# EasyEDA schematic easyeda-doit-devkit-v1.json
TITLE: Sheet_1; REV: 1.0; Date: 2025-05-14; Sheet: 1/1; Drawn By: pgalantha; Company: Your Company
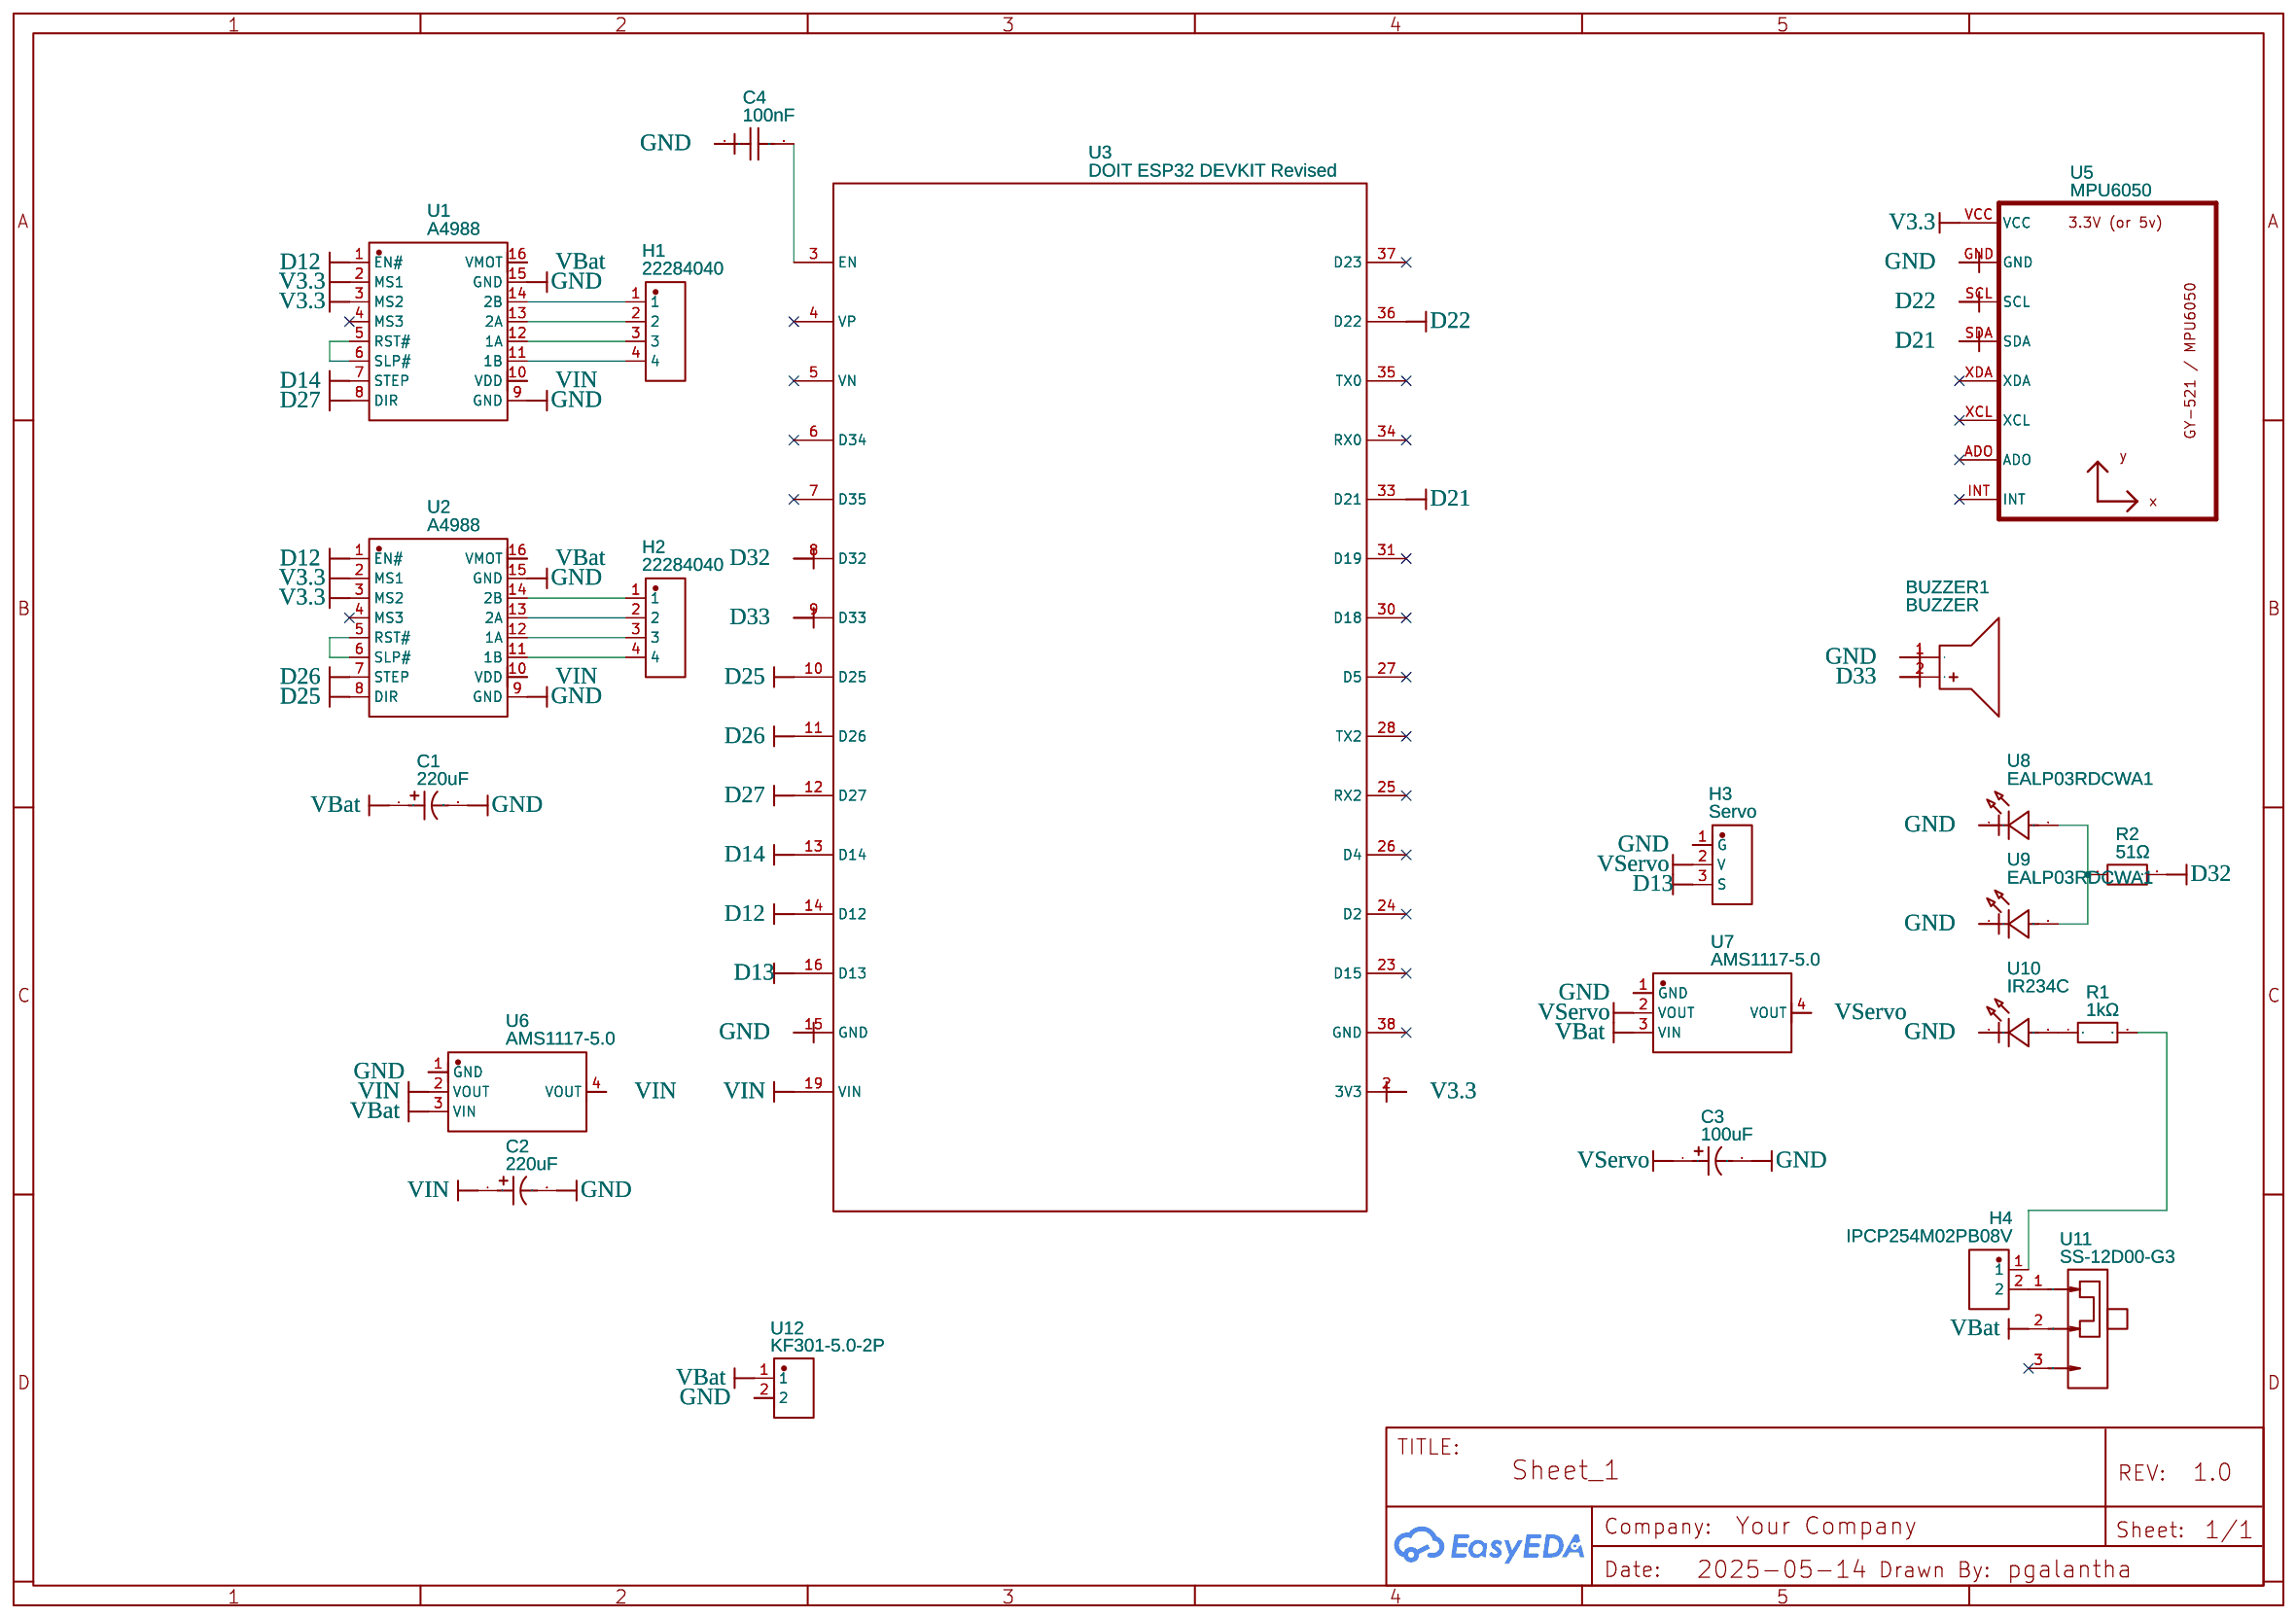
[diagram p0: schematic sheet]

## Parts
BUZZER1  BUZZER  [BUZ-TH_BD12.0-P6.00-D0.9-RD]
C1  220uF  [CAP-TH_BD6.3-P2.50-D0.5-FD]
C2  220uF  [CAP-TH_BD6.3-P2.50-D0.5-FD]
C3  100uF  [CAP-TH_BD5.0-P2.00-D0.5-FD-1]
C4  100nF  [CAP-TH_L5.0-W2.5-P5.00-D1.0]
H1  22284040  [HDR-TH_4P-P2.54-V-M]
H2  22284040  [HDR-TH_4P-P2.54-V-M]
H3  Servo  [HDR-TH_3P-P2.54-V-M]
H4  IPCP254M02PB08V  [HDR-TH_2P-P2.54-V-M]
R1  1kΩ  [RES-TH_BD3.3-L9.2-P13.20-D0.6]
R2  51Ω  [RES-TH_BD3.3-L9.2-P13.20-D0.6]
U1  A4988  [DIP-16_L20.3-W15.2-P2.54_LS12.7_A4988]
U2  A4988  [DIP-16_L20.3-W15.2-P2.54_LS12.7_A4988]
U3  DOIT ESP32 DEVKIT Revised  [DOIT-ESP32-DEVKIT-V1-REVISED]
U5  MPU6050  [MPU6050]
U6  AMS1117-5.0  [SOT-223_L6.5-W3.5-P2.30-LS7.0-BR]
U7  AMS1117-5.0  [SOT-223_L6.5-W3.5-P2.30-LS7.0-BR]
U8  EALP03RDCWA1  [LED-TH_BD3.0-P2.54-RD]
U9  EALP03RDCWA1  [LED-TH_BD3.0-P2.54-RD]
U10  IR234C  [LED-TH_BD3.0-P2.54-RD]
U11  SS-12D00-G3  [SW-TH_3P-L8.8-W3.9-P2.50_SS12D00G3]
U12  KF301-5.0-2P  [CONN-TH_P5.00_KF301-5.0-2P]

## Library data of the parts
BUZZER1 = BUZZER: Contributor: lcsc; Supplier: LCSC; Supplier Part: C9900014030; Manufacturer: null; Manufacturer Part: buzzer; JLCPCB Part Class: Extended Part
C1 C2 = SY221M016E070A: Contributor: lcsc; Supplier: LCSC; Supplier Part: C531135; Manufacturer: CapXon(丰宾); JLCPCB Part Class: Extended Part
C3 = 16V100UF CD288: Contributor: lcsc; Supplier: LCSC; Supplier Part: C2960195; Manufacturer: HRK(鸿瑞凯电子); Manufacturer Part: 16V100uF CD288; JLCPCB Part Class: Extended Part
C4 = CC1H104MC1FD3F6C10MF: Contributor: LCSC; Supplier: LCSC; Supplier Part: C254085; Manufacturer: Dersonic(德尔创); JLCPCB Part Class: Extended Part
H1 H2 = 22284040: Contributor: LCSC; Supplier: LCSC; Supplier Part: C587039; Manufacturer: MOLEX; JLCPCB Part Class: Extended Part
H3 = 22284035: Contributor: LCSC; Supplier: LCSC; Supplier Part: C587038; Manufacturer: MOLEX; JLCPCB Part Class: Extended Part
H4 = IPCP254M02PB08V: Supplier: LCSC; Supplier Part: C22395601; Manufacturer: INCP; JLCPCB Part Class: Extended Part; Contributor: lcsc
R1 = RN1WS1KΩFT/BA1: Contributor: LCSC; Supplier: LCSC; Supplier Part: C385291; Manufacturer: Tyohm(幸亚电阻); JLCPCB Part Class: Extended Part
R2 = RN 1/2W 51R F T/B A1: Contributor: LCSC; Supplier: LCSC; Supplier Part: C433505; Manufacturer: Tyohm(幸亚电阻); JLCPCB Part Class: Extended Part
U1 U2 = A4988: Supplier: LCSC; Supplier Part: C9900168373; Manufacturer: null; Contributor: lcsc
U3 = DOIT ESP32 DEVKIT Revised: Manufacturer: Espressif Systems; Manufacturer Part: M103QH3200PH3Q0; Supplier: Digi-Key; Supplier Part: 1904-ESP32-WROOM-32; link: https://www.digikey.com.au/en/products/detail/espressif-systems/ESP32-WROOM-32-M103QH3200PH3Q0/17887554; Contributor: syzygy36au
U5 = MPU6050: Contributor: salman hamid
U6 U7 = AMS1117-5.0: sourceId: HltLFyQwq; Supplier: LCSC; Manufacturer: AMS; Supplier Part: C6187; JLCPCB Part Class: Basic Part
U8 U9 = EALP03RDCWA1: Supplier: LCSC; Supplier Part: C2992760; Manufacturer: EVERLIGHT(亿光); JLCPCB Part Class: Extended Part; Contributor: lcsc
U10 = IR234C: Supplier: LCSC; Supplier Part: C5201641; Manufacturer: EVERLIGHT(亿光); JLCPCB Part Class: Extended Part; Contributor: lcsc
U11 = SS-12D00-G3: Supplier: LCSC; Supplier Part: C22355741; Manufacturer: SOFNG(硕方); Contributor: lcsc; JLCPCB Part Class: Extended Part
U12 = KF301-5.0-2P: Contributor: LCSC; Supplier: LCSC; Supplier Part: C474881; Manufacturer: KEFA(科发); JLCPCB Part Class: Extended Part

## Nets
GND: BUZZER1.1(-) C1.2 C2.2 C3.2 C4.1 H3.1(G) U1.9(GND) U1.15(GND) U2.9(GND) U2.15(GND) U3.15(GND) U5.GND U6.1(GND) U7.1(GND) U8.1(K) U9.1(K) U10.1(C) U12.2
V3.3: U1.2(MS1) U1.3(MS2) U2.2(MS1) U2.3(MS2) U3.2(3V3) U5.VCC
VBat: C1.1 U1.16(VMOT) U2.16(VMOT) U6.3(VIN) U7.3(VIN) U11.2 U12.1
VIN: C2.1 U1.10(VDD) U2.10(VDD) U3.19(VIN) U6.2(VOUT) U6.4(VOUT)
D12: U1.1(EN#) U2.1(EN#) U3.14(D12)
D13: H3.3(S) U3.16(D13)
D14: U1.7(STEP) U3.13(D14)
D21: U3.33(D21) U5.SDA
D22: U3.36(D22) U5.SCL
D25: U2.8(DIR) U3.10(D25)
D26: U2.7(STEP) U3.11(D26)
D27: U1.8(DIR) U3.12(D27)
D32: R2.2 U3.8(D32)
D33: BUZZER1.2(+) U3.9(D33)
VServo: C3.1 H3.2(V) U7.2(VOUT) U7.4(VOUT)
Net-(C4-2): C4.2 U3.3(EN)
Net-(H1-1): H1.1 U1.14(2B)
Net-(H1-2): H1.2 U1.13(2A)
Net-(H1-3): H1.3 U1.12(1A)
Net-(H1-4): H1.4 U1.11(1B)
Net-(H2-1): H2.1 U2.14(2B)
Net-(H2-2): H2.2 U2.13(2A)
Net-(H2-3): H2.3 U2.12(1A)
Net-(H2-4): H2.4 U2.11(1B)
Net-(H4-1): H4.1 R1.2
Net-(H4-2): H4.2 U11.1
Net-(R1-1): R1.1 U10.2(A)
Net-(R2-1): R2.1 U8.2(A) U9.2(A)
Net-(U1-5): U1.5(RST#) U1.6(SLP#)
Net-(U2-5): U2.5(RST#) U2.6(SLP#)

Not connected (* = marked no-connect by the designer): U1 4(MS3)*; U2 4(MS3)*; U3 4(VP)* 5(VN)* 6(D34)* 7(D35)* 23(D15)* 24(D2)* 25(RX2)* 26(D4)* 27(D5)* 28(TX2)* 30(D18)* 31(D19)* 34(RX0)* 35(TX0)* 37(D23)* 38(GND)*; U5 ADO* INT* XCL* XDA*; U11 3*
